# EAGLE schematic KeyVelocitysch (EAGLE 4.13)
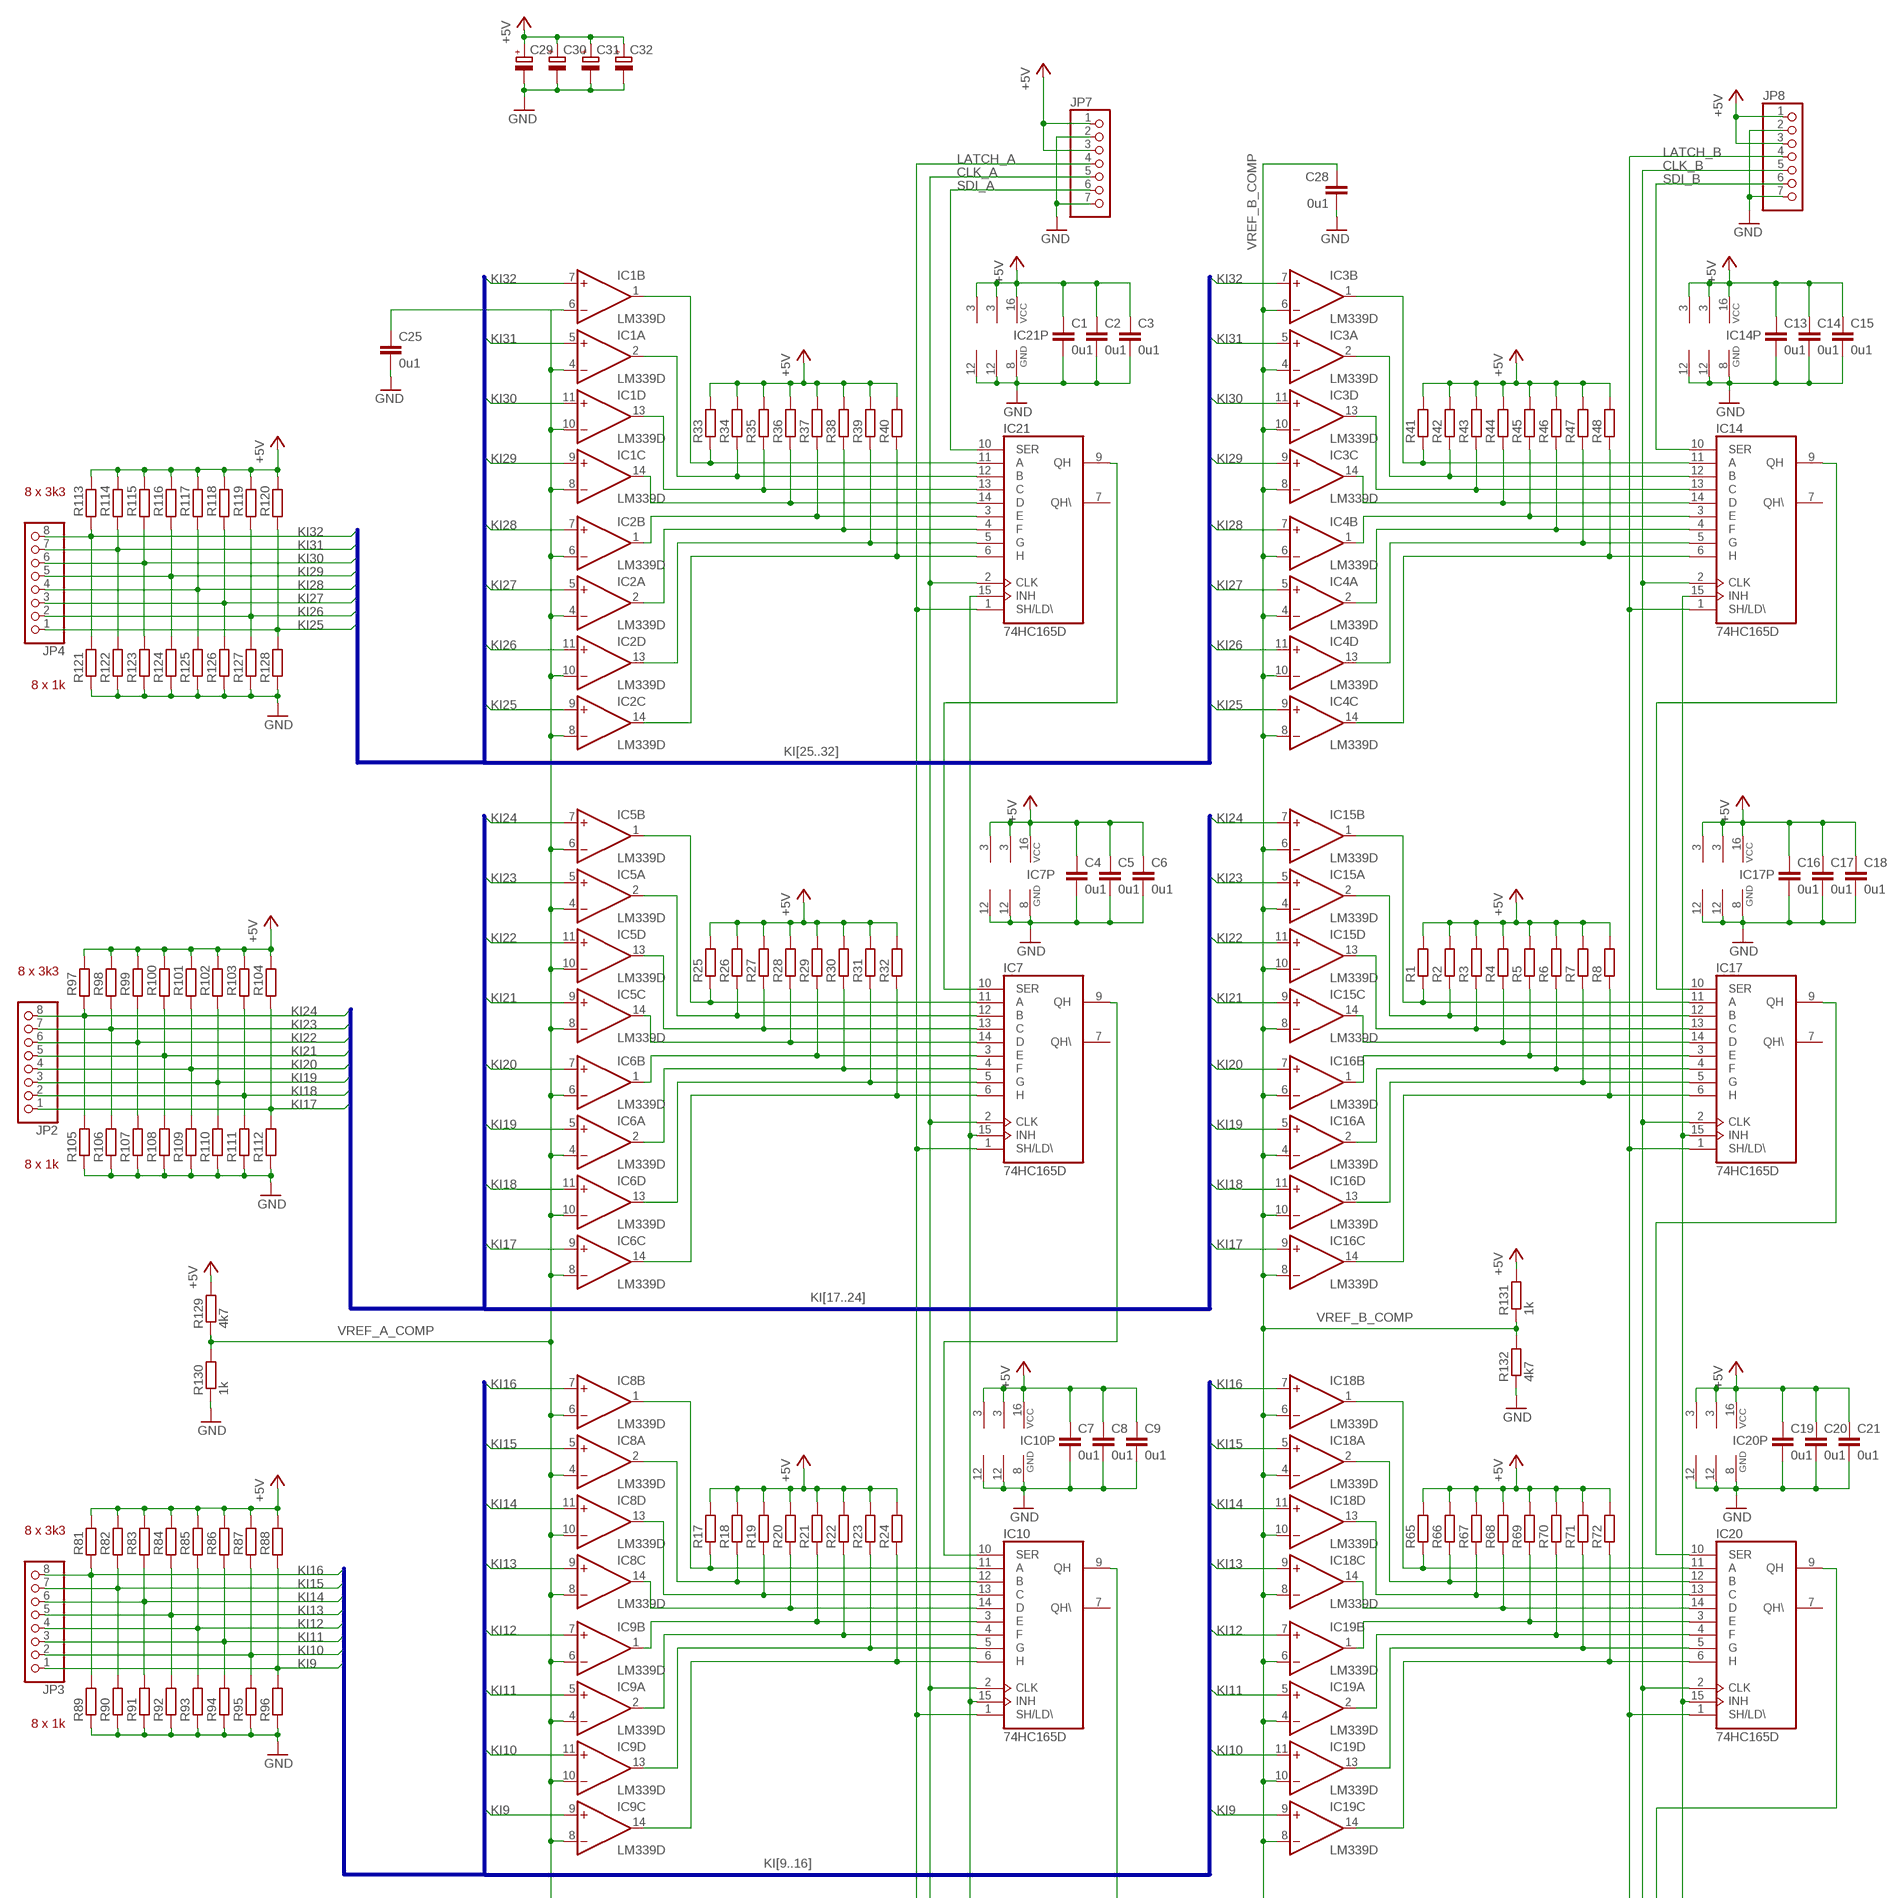
[diagram p0: schematic, sheet 1, part 1 of 2]
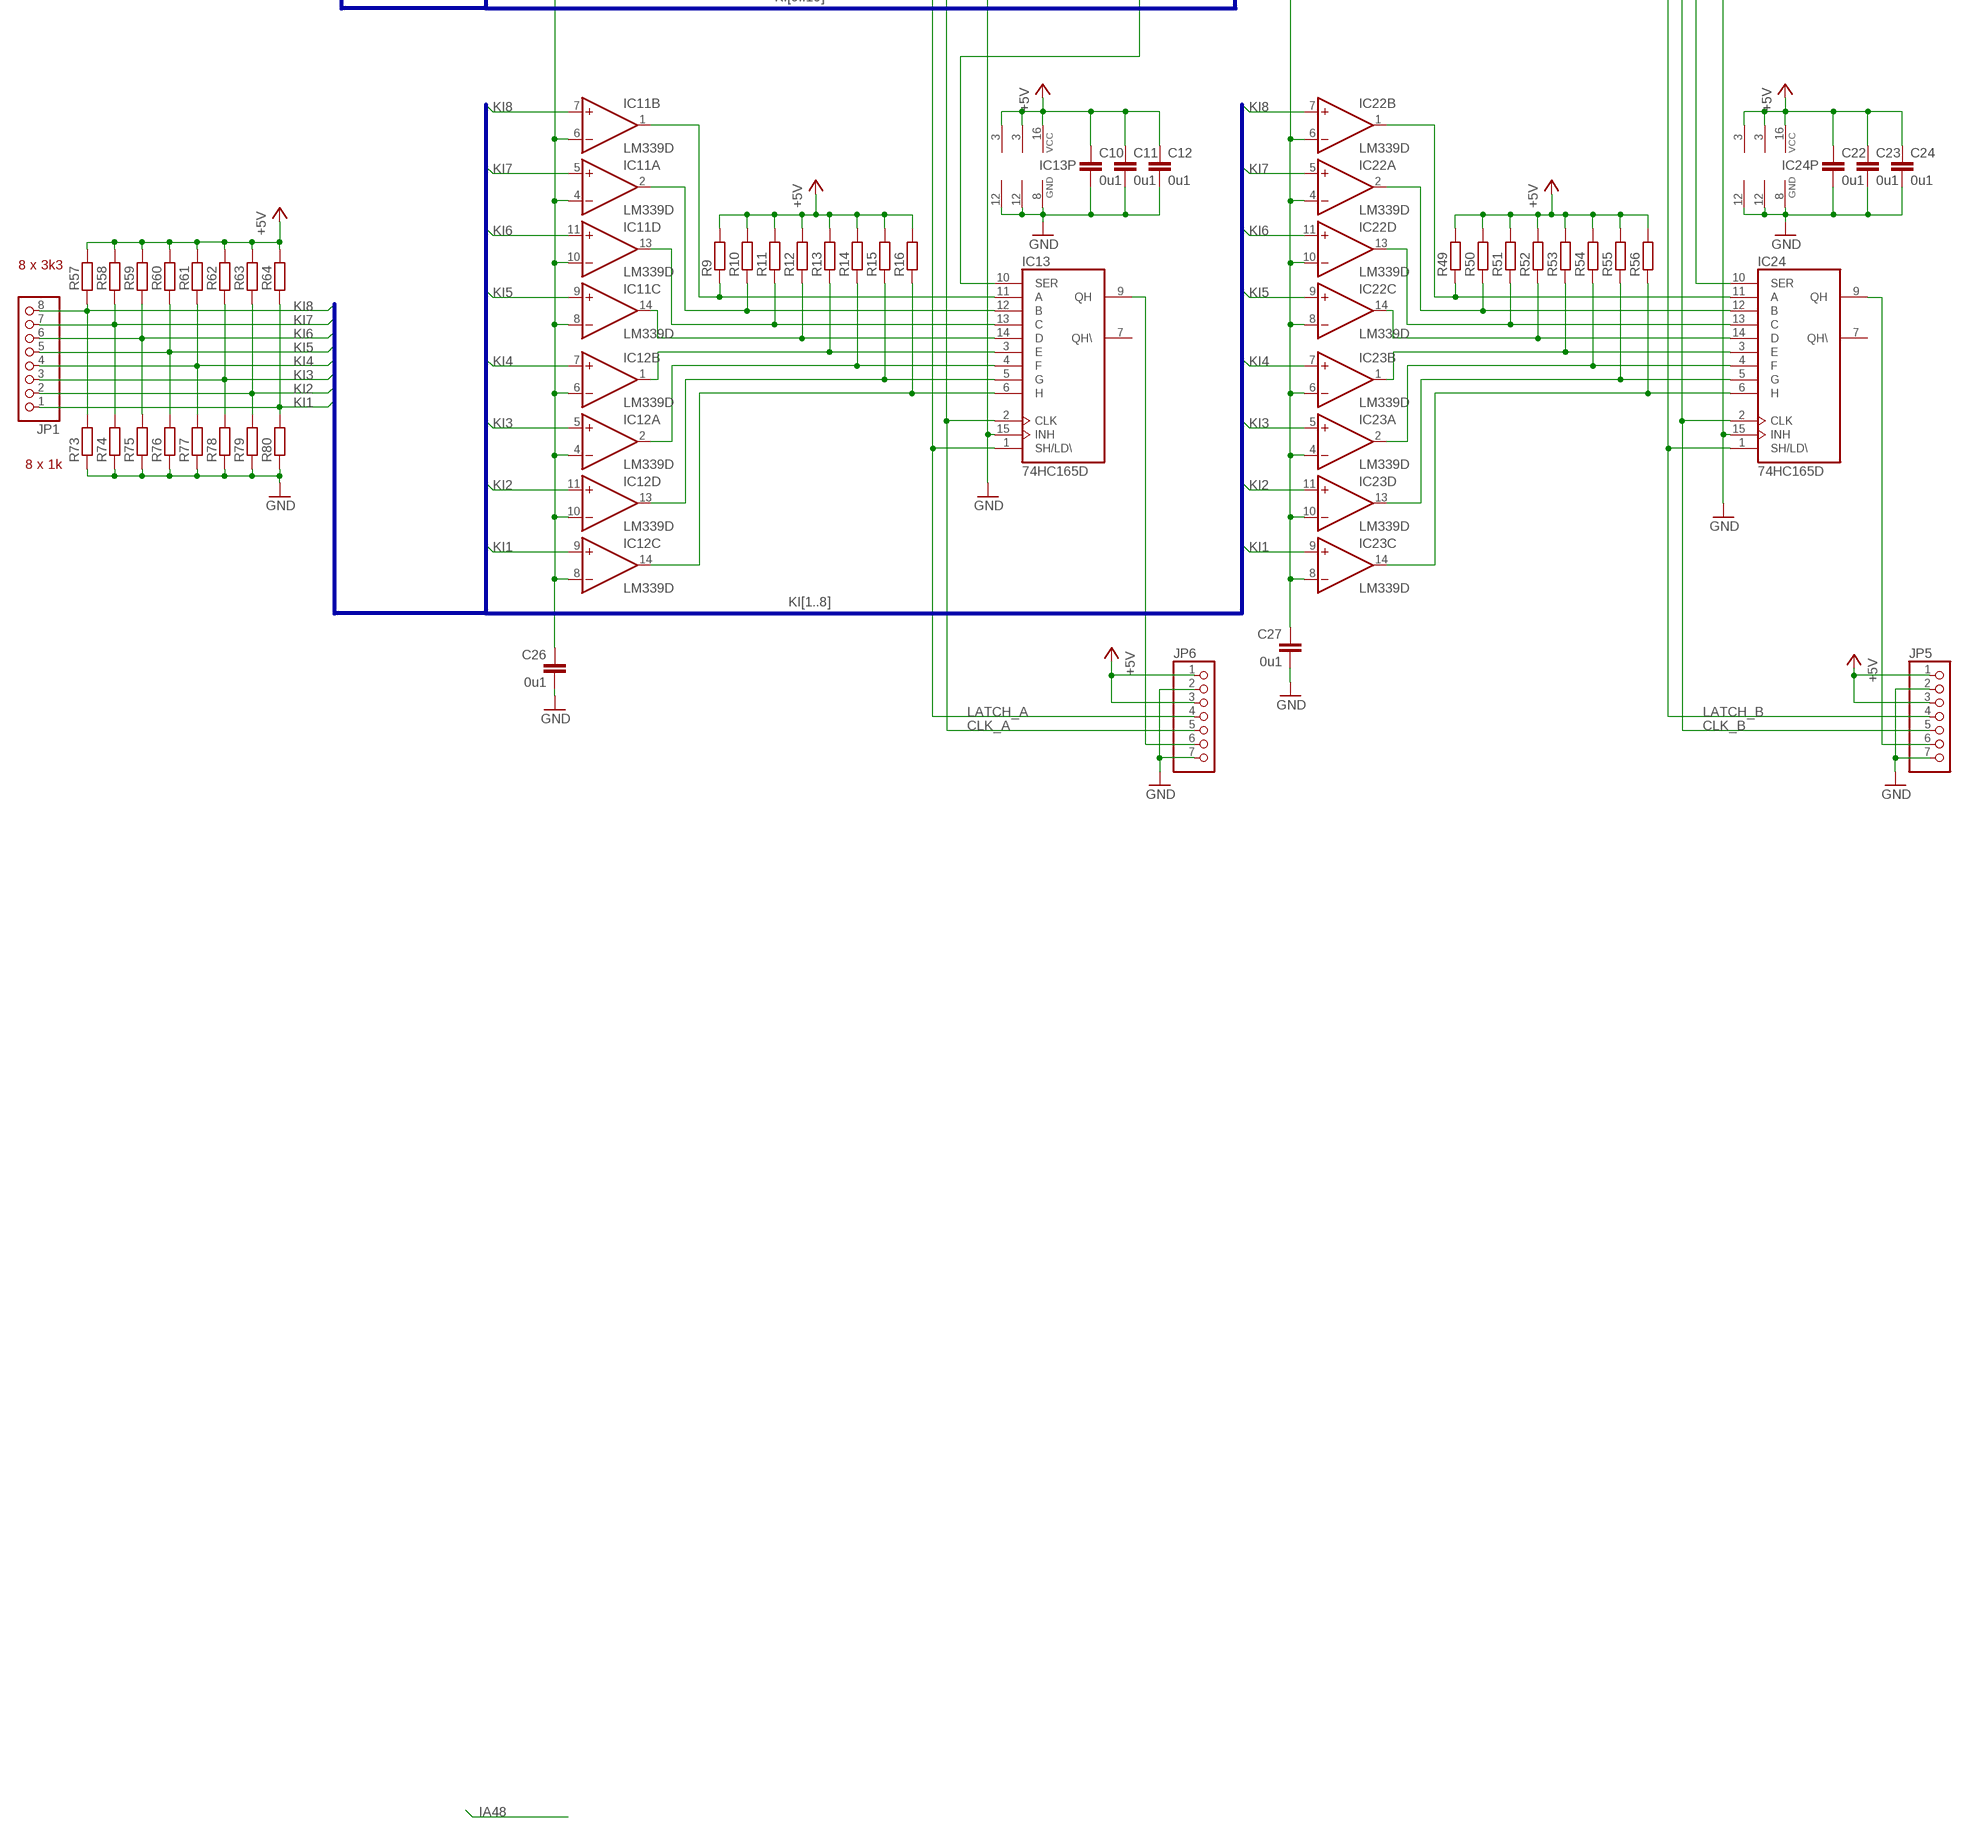
[diagram p1: schematic, sheet 1, part 2 of 2]

## Parts
C1  0u1  C-EUC0603  [C0603]
C2  0u1  C-EUC0603  [C0603]
C3  0u1  C-EUC0603  [C0603]
C4  0u1  C-EUC0603  [C0603]
C5  0u1  C-EUC0603  [C0603]
C6  0u1  C-EUC0603  [C0603]
C7  0u1  C-EUC0603  [C0603]
C8  0u1  C-EUC0603  [C0603]
C9  0u1  C-EUC0603  [C0603]
C10  0u1  C-EUC0603  [C0603]
C11  0u1  C-EUC0603  [C0603]
C12  0u1  C-EUC0603  [C0603]
C13  0u1  C-EUC0603  [C0603]
C14  0u1  C-EUC0603  [C0603]
C15  0u1  C-EUC0603  [C0603]
C16  0u1  C-EUC0603  [C0603]
C17  0u1  C-EUC0603  [C0603]
C18  0u1  C-EUC0603  [C0603]
C19  0u1  C-EUC0603  [C0603]
C20  0u1  C-EUC0603  [C0603]
C21  0u1  C-EUC0603  [C0603]
C22  0u1  C-EUC0603  [C0603]
C23  0u1  C-EUC0603  [C0603]
C24  0u1  C-EUC0603  [C0603]
C25  0u1  C-EUC0603  [C0603]
C26  0u1  C-EUC0603  [C0603]
C27  0u1  C-EUC0603  [C0603]
C28  0u1  C-EUC0603  [C0603]
C29  CPOL-EUE2.5-5  [E2,5-5]
C30  CPOL-EUE2.5-5  [E2,5-5]
C31  CPOL-EUE2.5-5  [E2,5-5]
C32  CPOL-EUE2.5-5  [E2,5-5]
IC1  LM339D  [SO14]
IC2  LM339D  [SO14]
IC3  LM339D  [SO14]
IC4  LM339D  [SO14]
IC5  LM339D  [SO14]
IC6  LM339D  [SO14]
IC7  74HC165D  [SO16]
IC8  LM339D  [SO14]
IC9  LM339D  [SO14]
IC10  74HC165D  [SO16]
IC11  LM339D  [SO14]
IC12  LM339D  [SO14]
IC13  74HC165D  [SO16]
IC14  74HC165D  [SO16]
IC15  LM339D  [SO14]
IC16  LM339D  [SO14]
IC17  74HC165D  [SO16]
IC18  LM339D  [SO14]
IC19  LM339D  [SO14]
IC20  74HC165D  [SO16]
IC21  74HC165D  [SO16]
IC22  LM339D  [SO14]
IC23  LM339D  [SO14]
IC24  74HC165D  [SO16]
JP1  PINHD-1X8  [1X08]
JP2  PINHD-1X8  [1X08]
JP3  PINHD-1X8  [1X08]
JP4  PINHD-1X8  [1X08]
JP5  PINHD-1X7  [1X07]
JP6  PINHD-1X7  [1X07]
JP7  PINHD-1X7  [1X07]
JP8  PINHD-1X7  [1X07]
R1  R-EU_R0402  [R0402]
R2  R-EU_R0402  [R0402]
R3  R-EU_R0402  [R0402]
R4  R-EU_R0402  [R0402]
R5  R-EU_R0402  [R0402]
R6  R-EU_R0402  [R0402]
R7  R-EU_R0402  [R0402]
R8  R-EU_R0402  [R0402]
R9  R-EU_R0402  [R0402]
R10  R-EU_R0402  [R0402]
R11  R-EU_R0402  [R0402]
R12  R-EU_R0402  [R0402]
R13  R-EU_R0402  [R0402]
R14  R-EU_R0402  [R0402]
R15  R-EU_R0402  [R0402]
R16  R-EU_R0402  [R0402]
R17  R-EU_R0402  [R0402]
R18  R-EU_R0402  [R0402]
R19  R-EU_R0402  [R0402]
R20  R-EU_R0402  [R0402]
R21  R-EU_R0402  [R0402]
R22  R-EU_R0402  [R0402]
R23  R-EU_R0402  [R0402]
R24  R-EU_R0402  [R0402]
R25  R-EU_R0402  [R0402]
R26  R-EU_R0402  [R0402]
R27  R-EU_R0402  [R0402]
R28  R-EU_R0402  [R0402]
R29  R-EU_R0402  [R0402]
R30  R-EU_R0402  [R0402]
R31  R-EU_R0402  [R0402]
R32  R-EU_R0402  [R0402]
R33  R-EU_R0402  [R0402]
R34  R-EU_R0402  [R0402]
R35  R-EU_R0402  [R0402]
R36  R-EU_R0402  [R0402]
R37  R-EU_R0402  [R0402]
R38  R-EU_R0402  [R0402]
R39  R-EU_R0402  [R0402]
R40  R-EU_R0402  [R0402]
R41  R-EU_R0402  [R0402]
R42  R-EU_R0402  [R0402]
R43  R-EU_R0402  [R0402]
R44  R-EU_R0402  [R0402]
R45  R-EU_R0402  [R0402]
R46  R-EU_R0402  [R0402]
R47  R-EU_R0402  [R0402]
R48  R-EU_R0402  [R0402]
R49  R-EU_R0402  [R0402]
R50  R-EU_R0402  [R0402]
R51  R-EU_R0402  [R0402]
R52  R-EU_R0402  [R0402]
R53  R-EU_R0402  [R0402]
R54  R-EU_R0402  [R0402]
R55  R-EU_R0402  [R0402]
R56  R-EU_R0402  [R0402]
R57  R-EU_R0603  [R0603]
R58  R-EU_R0603  [R0603]
R59  R-EU_R0603  [R0603]
R60  R-EU_R0603  [R0603]
R61  R-EU_R0603  [R0603]
R62  R-EU_R0603  [R0603]
R63  R-EU_R0603  [R0603]
R64  R-EU_R0603  [R0603]
R65  R-EU_R0402  [R0402]
R66  R-EU_R0402  [R0402]
R67  R-EU_R0402  [R0402]
R68  R-EU_R0402  [R0402]
R69  R-EU_R0402  [R0402]
R70  R-EU_R0402  [R0402]
R71  R-EU_R0402  [R0402]
R72  R-EU_R0402  [R0402]
R73  R-EU_R0603  [R0603]
R74  R-EU_R0603  [R0603]
R75  R-EU_R0603  [R0603]
R76  R-EU_R0603  [R0603]
R77  R-EU_R0603  [R0603]
R78  R-EU_R0603  [R0603]
R79  R-EU_R0603  [R0603]
R80  R-EU_R0603  [R0603]
R81  R-EU_R0603  [R0603]
R82  R-EU_R0603  [R0603]
R83  R-EU_R0603  [R0603]
R84  R-EU_R0603  [R0603]
R85  R-EU_R0603  [R0603]
R86  R-EU_R0603  [R0603]
R87  R-EU_R0603  [R0603]
R88  R-EU_R0603  [R0603]
R89  R-EU_R0603  [R0603]
R90  R-EU_R0603  [R0603]
R91  R-EU_R0603  [R0603]
R92  R-EU_R0603  [R0603]
R93  R-EU_R0603  [R0603]
R94  R-EU_R0603  [R0603]
R95  R-EU_R0603  [R0603]
R96  R-EU_R0603  [R0603]
R97  R-EU_R0603  [R0603]
R98  R-EU_R0603  [R0603]
R99  R-EU_R0603  [R0603]
R100  R-EU_R0603  [R0603]
R101  R-EU_R0603  [R0603]
R102  R-EU_R0603  [R0603]
R103  R-EU_R0603  [R0603]
R104  R-EU_R0603  [R0603]
R105  R-EU_R0603  [R0603]
R106  R-EU_R0603  [R0603]
R107  R-EU_R0603  [R0603]
R108  R-EU_R0603  [R0603]
R109  R-EU_R0603  [R0603]
R110  R-EU_R0603  [R0603]
R111  R-EU_R0603  [R0603]
R112  R-EU_R0603  [R0603]
R113  R-EU_R0603  [R0603]
R114  R-EU_R0603  [R0603]
R115  R-EU_R0603  [R0603]
R116  R-EU_R0603  [R0603]
R117  R-EU_R0603  [R0603]
R118  R-EU_R0603  [R0603]
R119  R-EU_R0603  [R0603]
R120  R-EU_R0603  [R0603]
R121  R-EU_R0603  [R0603]
R122  R-EU_R0603  [R0603]
R123  R-EU_R0603  [R0603]
R124  R-EU_R0603  [R0603]
R125  R-EU_R0603  [R0603]
R126  R-EU_R0603  [R0603]
R127  R-EU_R0603  [R0603]
R128  R-EU_R0603  [R0603]
R129  4k7  R-EU_R0603  [R0603]
R130  1k  R-EU_R0603  [R0603]
R131  1k  R-EU_R0603  [R0603]
R132  4k7  R-EU_R0603  [R0603]

## Nets
+5V: C1.1 C2.1 C3.1 C4.1 C5.1 C6.1 C7.1 C8.1 C9.1 C10.1 C11.1 C12.1 C13.1 C14.1 C15.1 C16.1 C17.1 C18.1 C19.1 C20.1 C21.1 C22.1 C23.1 C24.1 C29.+ C30.+ C31.+ C32.+ IC1.3(P:V+) IC2.3(P:V+) IC3.3(P:V+) IC4.3(P:V+) IC5.3(P:V+) IC6.3(P:V+) IC7.16(VCC) IC8.3(P:V+) IC9.3(P:V+) IC10.16(VCC) IC11.3(P:V+) IC12.3(P:V+) IC13.16(VCC) IC14.16(VCC) IC15.3(P:V+) IC16.3(P:V+) IC17.16(VCC) IC18.3(P:V+) IC19.3(P:V+) IC20.16(VCC) IC21.16(VCC) IC22.3(P:V+) IC23.3(P:V+) IC24.16(VCC) JP5.1 JP5.3 JP6.1 JP6.3 JP7.1 JP7.3 JP8.1 JP8.3 R1.2 R2.2 R3.2 R4.2 R5.2 R6.2 R7.2 R8.2 R9.2 R10.2 R11.2 R12.2 R13.2 R14.2 R15.2 R16.2 R17.2 R18.2 R19.2 R20.2 R21.2 R22.2 R23.2 R24.2 R25.2 R26.2 R27.2 R28.2 R29.2 R30.2 R31.2 R32.2 R33.2 R34.2 R35.2 R36.2 R37.2 R38.2 R39.2 R40.2 R41.2 R42.2 R43.2 R44.2 R45.2 R46.2 R47.2 R48.2 R49.2 R50.2 R51.2 R52.2 R53.2 R54.2 R55.2 R56.2 R57.2 R58.2 R59.2 R60.2 R61.2 R62.2 R63.2 R64.2 R65.2 R66.2 R67.2 R68.2 R69.2 R70.2 R71.2 R72.2 R81.2 R82.2 R83.2 R84.2 R85.2 R86.2 R87.2 R88.2 R97.2 R98.2 R99.2 R100.2 R101.2 R102.2 R103.2 R104.2 R113.2 R114.2 R115.2 R116.2 R117.2 R118.2 R119.2 R120.2 R129.2 R131.2
CLK_A: IC7.2(CLK) IC10.2(CLK) IC13.2(CLK) IC21.2(CLK) JP6.5 JP7.5
CLK_B: IC14.2(CLK) IC17.2(CLK) IC20.2(CLK) IC24.2(CLK) JP5.5 JP8.5
DA1: IC12.14(C:OUT) IC13.6(H) R16.1
DA8: IC11.1(B:OUT) IC13.11(A) R9.1
DA9: IC9.14(C:OUT) IC10.6(H) R24.1
DA16: IC8.1(B:OUT) IC10.11(A) R17.1
DA17: IC6.14(C:OUT) IC7.6(H) R32.1
DA24: IC5.1(B:OUT) IC7.11(A) R25.1
DA25: IC2.14(C:OUT) IC21.6(H) R40.1
DA32: IC1.1(B:OUT) IC21.11(A) R33.1
DB1: IC23.14(C:OUT) IC24.6(H) R56.1
DB8: IC22.1(B:OUT) IC24.11(A) R49.1
DB9: IC19.14(C:OUT) IC20.6(H) R72.1
DB16: IC18.1(B:OUT) IC20.11(A) R65.1
DB17: IC16.14(C:OUT) IC17.6(H) R8.1
DB24: IC15.1(B:OUT) IC17.11(A) R1.1
DB25: IC4.14(C:OUT) IC14.6(H) R48.1
DB32: IC3.1(B:OUT) IC14.11(A) R41.1
GND: C1.2 C2.2 C3.2 C4.2 C5.2 C6.2 C7.2 C8.2 C9.2 C10.2 C11.2 C12.2 C13.2 C14.2 C15.2 C16.2 C17.2 C18.2 C19.2 C20.2 C21.2 C22.2 C23.2 C24.2 C25.2 C26.2 C27.2 C28.2 C29.- C30.- C31.- C32.- IC1.12(P:GND) IC2.12(P:GND) IC3.12(P:GND) IC4.12(P:GND) IC5.12(P:GND) IC6.12(P:GND) IC7.8(GND) IC7.15(INH) IC8.12(P:GND) IC9.12(P:GND) IC10.8(GND) IC10.15(INH) IC11.12(P:GND) IC12.12(P:GND) IC13.8(GND) IC13.15(INH) IC14.8(GND) IC14.15(INH) IC15.12(P:GND) IC16.12(P:GND) IC17.8(GND) IC17.15(INH) IC18.12(P:GND) IC19.12(P:GND) IC20.8(GND) IC20.15(INH) IC21.8(GND) IC21.15(INH) IC22.12(P:GND) IC23.12(P:GND) IC24.8(GND) IC24.15(INH) JP5.2 JP5.7 JP6.2 JP6.7 JP7.2 JP7.7 JP8.2 JP8.7 R73.1 R74.1 R75.1 R76.1 R77.1 R78.1 R79.1 R80.1 R89.1 R90.1 R91.1 R92.1 R93.1 R94.1 R95.1 R96.1 R105.1 R106.1 R107.1 R108.1 R109.1 R110.1 R111.1 R112.1 R121.1 R122.1 R123.1 R124.1 R125.1 R126.1 R127.1 R128.1 R130.1 R132.1
KI1: IC12.9(C:+IN) IC23.9(C:+IN) JP1.1 R64.1 R80.2
KI2: IC12.11(D:+IN) IC23.11(D:+IN) JP1.2 R63.1 R79.2
KI3: IC12.5(A:+IN) IC23.5(A:+IN) JP1.3 R62.1 R78.2
KI4: IC12.7(B:+IN) IC23.7(B:+IN) JP1.4 R61.1 R77.2
KI5: IC11.9(C:+IN) IC22.9(C:+IN) JP1.5 R60.1 R76.2
KI6: IC11.11(D:+IN) IC22.11(D:+IN) JP1.6 R59.1 R75.2
KI7: IC11.5(A:+IN) IC22.5(A:+IN) JP1.7 R58.1 R74.2
KI8: IC11.7(B:+IN) IC22.7(B:+IN) JP1.8 R57.1 R73.2
KI9: IC9.9(C:+IN) IC19.9(C:+IN) JP3.1 R88.1 R96.2
KI10: IC9.11(D:+IN) IC19.11(D:+IN) JP3.2 R87.1 R95.2
KI11: IC9.5(A:+IN) IC19.5(A:+IN) JP3.3 R86.1 R94.2
KI12: IC9.7(B:+IN) IC19.7(B:+IN) JP3.4 R85.1 R93.2
KI13: IC8.9(C:+IN) IC18.9(C:+IN) JP3.5 R84.1 R92.2
KI14: IC8.11(D:+IN) IC18.11(D:+IN) JP3.6 R83.1 R91.2
KI15: IC8.5(A:+IN) IC18.5(A:+IN) JP3.7 R82.1 R90.2
KI16: IC8.7(B:+IN) IC18.7(B:+IN) JP3.8 R81.1 R89.2
KI17: IC6.9(C:+IN) IC16.9(C:+IN) JP2.1 R104.1 R112.2
KI18: IC6.11(D:+IN) IC16.11(D:+IN) JP2.2 R103.1 R111.2
KI19: IC6.5(A:+IN) IC16.5(A:+IN) JP2.3 R102.1 R110.2
KI20: IC6.7(B:+IN) IC16.7(B:+IN) JP2.4 R101.1 R109.2
KI21: IC5.9(C:+IN) IC15.9(C:+IN) JP2.5 R100.1 R108.2
KI22: IC5.11(D:+IN) IC15.11(D:+IN) JP2.6 R99.1 R107.2
KI23: IC5.5(A:+IN) IC15.5(A:+IN) JP2.7 R98.1 R106.2
KI24: IC5.7(B:+IN) IC15.7(B:+IN) JP2.8 R97.1 R105.2
KI25: IC2.9(C:+IN) IC4.9(C:+IN) JP4.1 R120.1 R128.2
KI26: IC2.11(D:+IN) IC4.11(D:+IN) JP4.2 R119.1 R127.2
KI27: IC2.5(A:+IN) IC4.5(A:+IN) JP4.3 R118.1 R126.2
KI28: IC2.7(B:+IN) IC4.7(B:+IN) JP4.4 R117.1 R125.2
KI29: IC1.9(C:+IN) IC3.9(C:+IN) JP4.5 R116.1 R124.2
KI30: IC1.11(D:+IN) IC3.11(D:+IN) JP4.6 R115.1 R123.2
KI31: IC1.5(A:+IN) IC3.5(A:+IN) JP4.7 R114.1 R122.2
KI32: IC1.7(B:+IN) IC3.7(B:+IN) JP4.8 R113.1 R121.2
LATCH_A: IC7.1(SH/LD\) IC10.1(SH/LD\) IC13.1(SH/LD\) IC21.1(SH/LD\) JP6.4 JP7.4
LATCH_B: IC14.1(SH/LD\) IC17.1(SH/LD\) IC20.1(SH/LD\) IC24.1(SH/LD\) JP5.4 JP8.4
N$1: IC14.9(QH) IC17.10(SER)
N$2: IC17.9(QH) IC20.10(SER)
N$4: IC12.13(D:OUT) IC13.5(G) R15.1
N$5: IC20.9(QH) IC24.10(SER)
N$6: IC24.9(QH) JP5.6
N$9: IC12.2(A:OUT) IC13.4(F) R14.1
N$10: IC12.1(B:OUT) IC13.3(E) R13.1
N$11: IC11.14(C:OUT) IC13.14(D) R12.1
N$12: IC7.10(SER) IC21.9(QH)
N$13: IC11.13(D:OUT) IC13.13(C) R11.1
N$14: IC11.2(A:OUT) IC13.12(B) R10.1
N$17: IC8.2(A:OUT) IC10.12(B) R18.1
N$18: IC8.13(D:OUT) IC10.13(C) R19.1
N$19: IC8.14(C:OUT) IC10.14(D) R20.1
N$20: IC9.1(B:OUT) IC10.3(E) R21.1
N$21: IC9.2(A:OUT) IC10.4(F) R22.1
N$22: IC7.9(QH) IC10.10(SER)
N$23: IC9.13(D:OUT) IC10.5(G) R23.1
N$25: IC10.9(QH) IC13.10(SER)
N$27: IC5.2(A:OUT) IC7.12(B) R26.1
N$28: IC5.13(D:OUT) IC7.13(C) R27.1
N$29: IC5.14(C:OUT) IC7.14(D) R28.1
N$30: IC6.1(B:OUT) IC7.3(E) R29.1
N$33: IC6.2(A:OUT) IC7.4(F) R30.1
N$34: IC13.9(QH) JP6.6
N$35: IC6.13(D:OUT) IC7.5(G) R31.1
N$38: IC1.2(A:OUT) IC21.12(B) R34.1
N$39: IC1.13(D:OUT) IC21.13(C) R35.1
N$40: IC1.14(C:OUT) IC21.14(D) R36.1
N$41: IC2.1(B:OUT) IC21.3(E) R37.1
N$42: IC2.2(A:OUT) IC21.4(F) R38.1
N$43: IC2.13(D:OUT) IC21.5(G) R39.1
N$46: IC22.2(A:OUT) IC24.12(B) R50.1
N$47: IC22.13(D:OUT) IC24.13(C) R51.1
N$48: IC22.14(C:OUT) IC24.14(D) R52.1
N$49: IC23.1(B:OUT) IC24.3(E) R53.1
N$50: IC23.2(A:OUT) IC24.4(F) R54.1
N$51: IC23.13(D:OUT) IC24.5(G) R55.1
N$54: IC18.2(A:OUT) IC20.12(B) R66.1
N$55: IC18.13(D:OUT) IC20.13(C) R67.1
N$56: IC18.14(C:OUT) IC20.14(D) R68.1
N$57: IC19.1(B:OUT) IC20.3(E) R69.1
N$58: IC19.2(A:OUT) IC20.4(F) R70.1
N$59: IC19.13(D:OUT) IC20.5(G) R71.1
N$62: IC15.2(A:OUT) IC17.12(B) R2.1
N$63: IC15.13(D:OUT) IC17.13(C) R3.1
N$64: IC15.14(C:OUT) IC17.14(D) R4.1
N$65: IC16.1(B:OUT) IC17.3(E) R5.1
N$66: IC16.2(A:OUT) IC17.4(F) R6.1
N$67: IC16.13(D:OUT) IC17.5(G) R7.1
N$70: IC3.2(A:OUT) IC14.12(B) R42.1
N$71: IC3.13(D:OUT) IC14.13(C) R43.1
N$72: IC3.14(C:OUT) IC14.14(D) R44.1
N$73: IC4.1(B:OUT) IC14.3(E) R45.1
N$74: IC4.2(A:OUT) IC14.4(F) R46.1
N$75: IC4.13(D:OUT) IC14.5(G) R47.1
SDI_A: IC21.10(SER) JP7.6
SDI_B: IC14.10(SER) JP8.6
VREF_A_COMP: C25.1 C26.1 IC1.4(A:-IN) IC1.6(B:-IN) IC1.8(C:-IN) IC1.10(D:-IN) IC2.4(A:-IN) IC2.6(B:-IN) IC2.8(C:-IN) IC2.10(D:-IN) IC5.4(A:-IN) IC5.6(B:-IN) IC5.8(C:-IN) IC5.10(D:-IN) IC6.4(A:-IN) IC6.6(B:-IN) IC6.8(C:-IN) IC6.10(D:-IN) IC8.4(A:-IN) IC8.6(B:-IN) IC8.8(C:-IN) IC8.10(D:-IN) IC9.4(A:-IN) IC9.6(B:-IN) IC9.8(C:-IN) IC9.10(D:-IN) IC11.4(A:-IN) IC11.6(B:-IN) IC11.8(C:-IN) IC11.10(D:-IN) IC12.4(A:-IN) IC12.6(B:-IN) IC12.8(C:-IN) IC12.10(D:-IN) R129.1 R130.2
VREF_B_COMP: C27.1 C28.1 IC3.4(A:-IN) IC3.6(B:-IN) IC3.8(C:-IN) IC3.10(D:-IN) IC4.4(A:-IN) IC4.6(B:-IN) IC4.8(C:-IN) IC4.10(D:-IN) IC15.4(A:-IN) IC15.6(B:-IN) IC15.8(C:-IN) IC15.10(D:-IN) IC16.4(A:-IN) IC16.6(B:-IN) IC16.8(C:-IN) IC16.10(D:-IN) IC18.4(A:-IN) IC18.6(B:-IN) IC18.8(C:-IN) IC18.10(D:-IN) IC19.4(A:-IN) IC19.6(B:-IN) IC19.8(C:-IN) IC19.10(D:-IN) IC22.4(A:-IN) IC22.6(B:-IN) IC22.8(C:-IN) IC22.10(D:-IN) IC23.4(A:-IN) IC23.6(B:-IN) IC23.8(C:-IN) IC23.10(D:-IN) R131.1 R132.2
Unconnected: IC7.7(QH\) IC10.7(QH\) IC13.7(QH\) IC14.7(QH\) IC17.7(QH\) IC20.7(QH\) IC21.7(QH\) IC24.7(QH\)

## Buses
KI[25..32]
KI[17..24]
KI[9..16]
KI[1..8]

## Notes on the sheet
- 8 x 3k3
- 8 x 1k
- 8 x 3k3
- 8 x 1k
- 8 x 3k3
- 8 x 1k
- 8 x 3k3
- 8 x 1k

## Library data of the parts
C1-C28 = rcl:C-EU: CAPACITOR, European symbol
C29-C32 = rcl:CPOL-EU: POLARIZED CAPACITOR, European symbol
IC1-IC6 IC8 IC9 IC11 IC12 IC15 IC16 IC18 IC19 IC22 IC23 = linear:LM339: Low Power Low Offset Voltage Quad Comparators with open collector; LM139/LM239/LM339/LM2901/LM3302
IC7 IC10 IC13 IC14 IC17 IC20 IC21 IC24 = 74xx-eu:74*165: 8-bit parallel load SHIFT REGISTER
JP1-JP4 = pinhead:PINHD-1X8: PIN HEADER
JP5-JP8 = pinhead:PINHD-1X7: PIN HEADER
R1-R132 = rcl:R-EU_: RESISTOR, European symbol